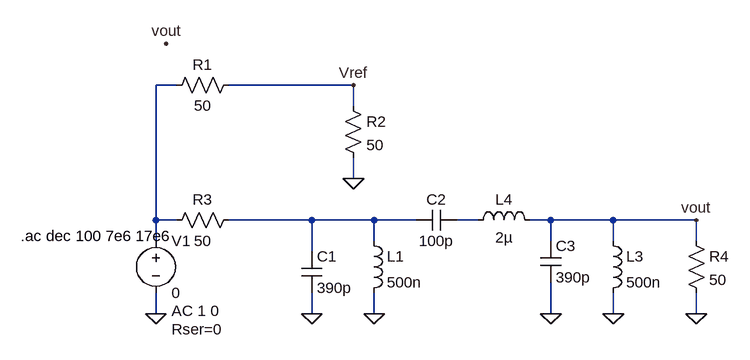
[diagram p0: schematic BPF_Updated.asc]
BPF_Updated.asc, the LTspice schematic file:
Version 4.1
SHEET 1 880 680
WIRE 16 64 -16 64
WIRE 288 64 96 64
WIRE 288 96 288 64
WIRE 288 208 288 176
WIRE -16 272 -16 64
WIRE 16 272 -16 272
WIRE 224 272 96 272
WIRE 320 272 224 272
WIRE 384 272 320 272
WIRE 480 272 448 272
WIRE 592 272 560 272
WIRE 688 272 592 272
WIRE 816 272 688 272
WIRE -16 304 -16 272
WIRE 320 304 320 272
WIRE 592 304 592 272
WIRE 688 304 688 272
WIRE 816 304 816 272
WIRE 224 320 224 272
WIRE -16 416 -16 384
WIRE 224 416 224 384
WIRE 320 416 320 384
WIRE 592 416 592 368
WIRE 688 416 688 384
WIRE 816 416 816 384
FLAG 288 208 0
FLAG -16 416 0
FLAG 224 416 0
FLAG 320 416 0
FLAG 816 416 0
FLAG 288 64 Vref
FLAG 816 272 vout
FLAG 0 0 vout
FLAG 592 416 0
FLAG 688 416 0
SYMBOL res 0 80 R270
WINDOW 0 32 56 VTop 2
WINDOW 3 0 56 VBottom 2
SYMATTR InstName R1
SYMATTR Value 50
SYMBOL res 272 80 R0
SYMATTR InstName R2
SYMATTR Value 50
SYMBOL res 112 256 R90
WINDOW 0 0 56 VBottom 2
WINDOW 3 32 56 VTop 2
SYMATTR InstName R3
SYMATTR Value 50
SYMBOL cap 208 320 R0
SYMATTR InstName C1
SYMATTR Value 390p
SYMBOL voltage -16 288 R0
WINDOW 123 24 124 Left 2
WINDOW 39 24 152 Left 2
SYMATTR Value2 AC 1 0
SYMATTR SpiceLine Rser=0
SYMATTR InstName V1
SYMATTR Value 0
SYMBOL ind 304 288 R0
SYMATTR InstName L1
SYMATTR Value 500n
SYMBOL res 800 288 R0
SYMATTR InstName R4
SYMATTR Value 50
SYMBOL cap 576 304 R0
SYMATTR InstName C3
SYMATTR Value 390p
SYMBOL ind 672 288 R0
SYMATTR InstName L3
SYMATTR Value 500n
SYMBOL ind 464 288 R270
WINDOW 0 32 56 VTop 2
WINDOW 3 5 56 VBottom 2
SYMATTR InstName L4
SYMATTR Value 2µ
SYMBOL cap 448 256 R90
WINDOW 0 0 32 VBottom 2
WINDOW 3 32 32 VTop 2
SYMATTR InstName C2
SYMATTR Value 100p
TEXT -224 296 Left 2 !.ac dec 100 7e6 17e6

The netlist it stands for:
* BPF_Updated.asc
R1 N001 Vref 50
R2 Vref 0 50
R3 N002 N001 50
C1 N002 0 390p
V1 N001 0 0 AC 1 0 Rser=0
L1 N002 0 500n
R4 vout 0 50
C3 vout 0 390p
L3 vout 0 500n
L4 N003 vout 2µ
C2 N003 N002 100p
.ac dec 100 7e6 17e6
.backanno
.end